# Altium schematic sheet DigitalInput.SchDoc
size A4; SheetNumber: 8; SheetTotal: 8
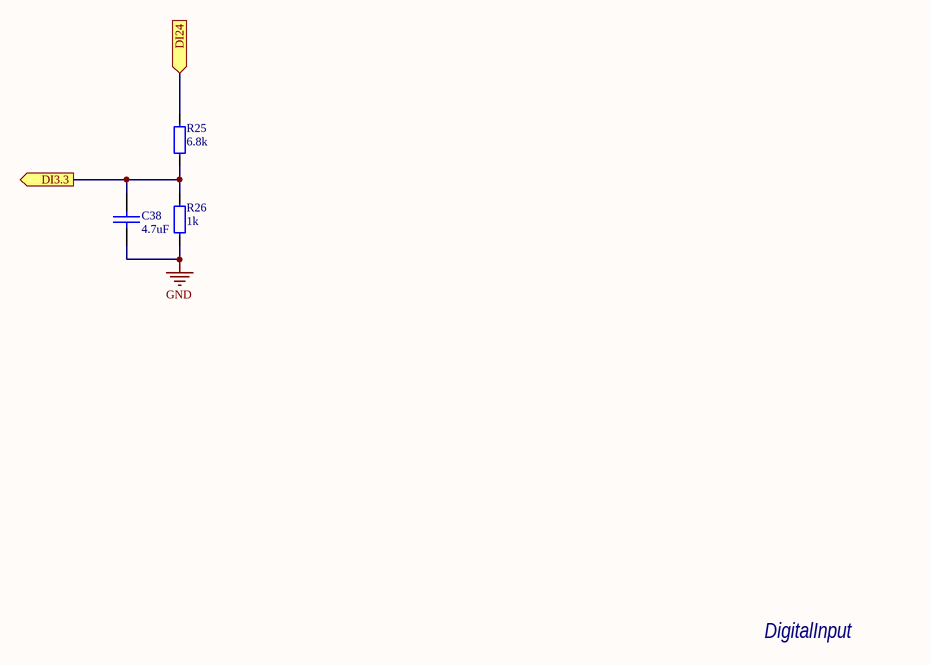
[diagram p0: DigitalInput.SchDoc]

## Parts
C38  4.7uF  [0603 Capicator]
R25  6.8k  [0603 Resistor]
R26  1k  [0603 Resistor]

## Ports
DI3.3 (out), DI24 (in)

## Nets
GND: C38.1 R26.1
DI3.3: C38.2 R25.1 R26.2 ; port DI3.3
DI24: R25.2 ; port DI24

## Notes on the sheet
- DigitalInput

## Library data of the parts
C38 = Cap 4.7uF (0603): 4.7uF X5R 25V 10% 0603; Manufacturer: Murata Manufacturing; Part Number: GRM188R61E475KE11D; Type: Capacitor; ComponentLink1Description: Chip&Dip; ComponentLink1URL: https://www.chipdip.ru/product0/9000348448
R25 = Res 6.8k (0603): 0.1W 0603 6.8k, 1%; Part Number: RC0603FR-076K8L; Manufacturer: Taiwan; Type: Resistor; ComponentLink1Description: Chip&Dip; ComponentLink1URL: https://www.chipdip.ru/product/0.1w-0603-6.8-kom-1
R26 = Res 1k (0603): 0.1W 0603 1k, 1%; Part Number: RC0603FR-071KL; Manufacturer: Taiwan; Type: Resistor; ComponentLink1Description: Chip&Dip; ComponentLink1URL: https://www.chipdip.ru/product0/9000079676